# Altium schematic sheet panel5.SchDoc
size A
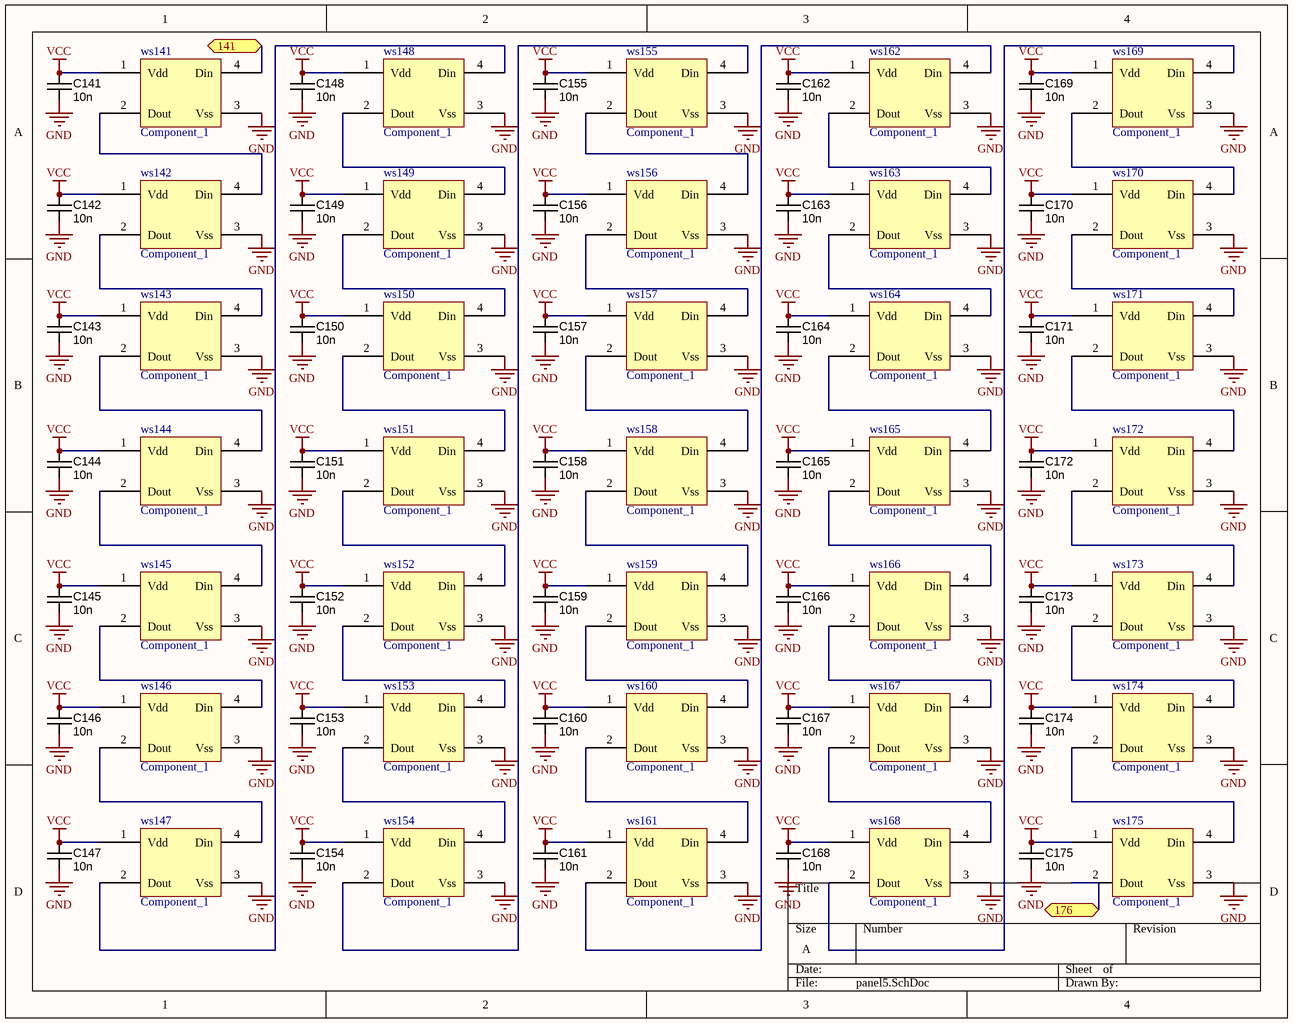
[diagram p0: panel5.SchDoc]

## Parts
C141  value 10n  [CAPC1608X90N]  (hidden comment: approved sub OK)
C142  value 10n  [CAPC1608X90N]  (hidden comment: approved sub OK)
C143  value 10n  [CAPC1608X90N]  (hidden comment: approved sub OK)
C144  value 10n  [CAPC1608X90N]  (hidden comment: approved sub OK)
C145  value 10n  [CAPC1608X90N]  (hidden comment: approved sub OK)
C146  value 10n  [CAPC1608X90N]  (hidden comment: approved sub OK)
C147  value 10n  [CAPC1608X90N]  (hidden comment: approved sub OK)
C148  value 10n  [CAPC1608X90N]  (hidden comment: approved sub OK)
C149  value 10n  [CAPC1608X90N]  (hidden comment: approved sub OK)
C150  value 10n  [CAPC1608X90N]  (hidden comment: approved sub OK)
C151  value 10n  [CAPC1608X90N]  (hidden comment: approved sub OK)
C152  value 10n  [CAPC1608X90N]  (hidden comment: approved sub OK)
C153  value 10n  [CAPC1608X90N]  (hidden comment: approved sub OK)
C154  value 10n  [CAPC1608X90N]  (hidden comment: approved sub OK)
C155  value 10n  [CAPC1608X90N]  (hidden comment: approved sub OK)
C156  value 10n  [CAPC1608X90N]  (hidden comment: approved sub OK)
C157  value 10n  [CAPC1608X90N]  (hidden comment: approved sub OK)
C158  value 10n  [CAPC1608X90N]  (hidden comment: approved sub OK)
C159  value 10n  [CAPC1608X90N]  (hidden comment: approved sub OK)
C160  value 10n  [CAPC1608X90N]  (hidden comment: approved sub OK)
C161  value 10n  [CAPC1608X90N]  (hidden comment: approved sub OK)
C162  value 10n  [CAPC1608X90N]  (hidden comment: approved sub OK)
C163  value 10n  [CAPC1608X90N]  (hidden comment: approved sub OK)
C164  value 10n  [CAPC1608X90N]  (hidden comment: approved sub OK)
C165  value 10n  [CAPC1608X90N]  (hidden comment: approved sub OK)
C166  value 10n  [CAPC1608X90N]  (hidden comment: approved sub OK)
C167  value 10n  [CAPC1608X90N]  (hidden comment: approved sub OK)
C168  value 10n  [CAPC1608X90N]  (hidden comment: approved sub OK)
C169  value 10n  [CAPC1608X90N]  (hidden comment: approved sub OK)
C170  value 10n  [CAPC1608X90N]  (hidden comment: approved sub OK)
C171  value 10n  [CAPC1608X90N]  (hidden comment: approved sub OK)
C172  value 10n  [CAPC1608X90N]  (hidden comment: approved sub OK)
C173  value 10n  [CAPC1608X90N]  (hidden comment: approved sub OK)
C174  value 10n  [CAPC1608X90N]  (hidden comment: approved sub OK)
C175  value 10n  [CAPC1608X90N]  (hidden comment: approved sub OK)
ws141  Component_1  [SOP4]
ws142  Component_1  [SOP4]
ws143  Component_1  [SOP4]
ws144  Component_1  [SOP4]
ws145  Component_1  [SOP4]
ws146  Component_1  [SOP4]
ws147  Component_1  [SOP4]
ws148  Component_1  [SOP4]
ws149  Component_1  [SOP4]
ws150  Component_1  [SOP4]
ws151  Component_1  [SOP4]
ws152  Component_1  [SOP4]
ws153  Component_1  [SOP4]
ws154  Component_1  [SOP4]
ws155  Component_1  [SOP4]
ws156  Component_1  [SOP4]
ws157  Component_1  [SOP4]
ws158  Component_1  [SOP4]
ws159  Component_1  [SOP4]
ws160  Component_1  [SOP4]
ws161  Component_1  [SOP4]
ws162  Component_1  [SOP4]
ws163  Component_1  [SOP4]
ws164  Component_1  [SOP4]
ws165  Component_1  [SOP4]
ws166  Component_1  [SOP4]
ws167  Component_1  [SOP4]
ws168  Component_1  [SOP4]
ws169  Component_1  [SOP4]
ws170  Component_1  [SOP4]
ws171  Component_1  [SOP4]
ws172  Component_1  [SOP4]
ws173  Component_1  [SOP4]
ws174  Component_1  [SOP4]
ws175  Component_1  [SOP4]

## Ports
141, 176

## Nets
GND: C141.2 C142.2 C143.2 C144.2 C145.2 C146.2 C147.2 C148.2 C149.2 C150.2 C151.2 C152.2 C153.2 C154.2 C155.2 C156.2 C157.2 C158.2 C159.2 C160.2 C161.2 C162.2 C163.2 C164.2 C165.2 C166.2 C167.2 C168.2 C169.2 C170.2 C171.2 C172.2 C173.2 C174.2 C175.2 ws141.3(Vss) ws142.3(Vss) ws143.3(Vss) ws144.3(Vss) ws145.3(Vss) ws146.3(Vss) ws147.3(Vss) ws148.3(Vss) ws149.3(Vss) ws150.3(Vss) ws151.3(Vss) ws152.3(Vss) ws153.3(Vss) ws154.3(Vss) ws155.3(Vss) ws156.3(Vss) ws157.3(Vss) ws158.3(Vss) ws159.3(Vss) ws160.3(Vss) ws161.3(Vss) ws162.3(Vss) ws163.3(Vss) ws164.3(Vss) ws165.3(Vss) ws166.3(Vss) ws167.3(Vss) ws168.3(Vss) ws169.3(Vss) ws170.3(Vss) ws171.3(Vss) ws172.3(Vss) ws173.3(Vss) ws174.3(Vss) ws175.3(Vss)
VCC: C141.1 C142.1 C143.1 C144.1 C145.1 C146.1 C147.1 C148.1 C149.1 C150.1 C151.1 C152.1 C153.1 C154.1 C155.1 C156.1 C157.1 C158.1 C159.1 C160.1 C161.1 C162.1 C163.1 C164.1 C165.1 C166.1 C167.1 C168.1 C169.1 C170.1 C171.1 C172.1 C173.1 C174.1 C175.1 ws141.1(Vdd) ws142.1(Vdd) ws143.1(Vdd) ws144.1(Vdd) ws145.1(Vdd) ws146.1(Vdd) ws147.1(Vdd) ws148.1(Vdd) ws149.1(Vdd) ws150.1(Vdd) ws151.1(Vdd) ws152.1(Vdd) ws153.1(Vdd) ws154.1(Vdd) ws155.1(Vdd) ws156.1(Vdd) ws157.1(Vdd) ws158.1(Vdd) ws159.1(Vdd) ws160.1(Vdd) ws161.1(Vdd) ws162.1(Vdd) ws163.1(Vdd) ws164.1(Vdd) ws165.1(Vdd) ws166.1(Vdd) ws167.1(Vdd) ws168.1(Vdd) ws169.1(Vdd) ws170.1(Vdd) ws171.1(Vdd) ws172.1(Vdd) ws173.1(Vdd) ws174.1(Vdd) ws175.1(Vdd)
141: ws141.4(Din) ; port 141
176: ws175.2(Dout) ; port 176
Netws141_2: ws141.2(Dout) ws142.4(Din)
Netws142_2: ws142.2(Dout) ws143.4(Din)
Netws143_2: ws143.2(Dout) ws144.4(Din)
Netws144_2: ws144.2(Dout) ws145.4(Din)
Netws145_2: ws145.2(Dout) ws146.4(Din)
Netws146_2: ws146.2(Dout) ws147.4(Din)
Netws147_2: ws147.2(Dout) ws148.4(Din)
Netws148_2: ws148.2(Dout) ws149.4(Din)
Netws149_2: ws149.2(Dout) ws150.4(Din)
Netws150_2: ws150.2(Dout) ws151.4(Din)
Netws151_2: ws151.2(Dout) ws152.4(Din)
Netws152_2: ws152.2(Dout) ws153.4(Din)
Netws153_2: ws153.2(Dout) ws154.4(Din)
Netws154_2: ws154.2(Dout) ws155.4(Din)
Netws155_2: ws155.2(Dout) ws156.4(Din)
Netws156_2: ws156.2(Dout) ws157.4(Din)
Netws157_2: ws157.2(Dout) ws158.4(Din)
Netws158_2: ws158.2(Dout) ws159.4(Din)
Netws159_2: ws159.2(Dout) ws160.4(Din)
Netws160_2: ws160.2(Dout) ws161.4(Din)
Netws161_2: ws161.2(Dout) ws162.4(Din)
Netws162_2: ws162.2(Dout) ws163.4(Din)
Netws163_2: ws163.2(Dout) ws164.4(Din)
Netws164_2: ws164.2(Dout) ws165.4(Din)
Netws165_2: ws165.2(Dout) ws166.4(Din)
Netws166_2: ws166.2(Dout) ws167.4(Din)
Netws167_2: ws167.2(Dout) ws168.4(Din)
Netws168_2: ws168.2(Dout) ws169.4(Din)
Netws169_2: ws169.2(Dout) ws170.4(Din)
Netws170_2: ws170.2(Dout) ws171.4(Din)
Netws171_2: ws171.2(Dout) ws172.4(Din)
Netws172_2: ws172.2(Dout) ws173.4(Din)
Netws173_2: ws173.2(Dout) ws174.4(Din)
Netws174_2: ws174.2(Dout) ws175.4(Din)

## Library data of the parts
C141-C175 = CAPC_10n_0603_X7R_100V_10%: Capacitor SMD Cer 10nF 10% 100V X7R 0603; Manufacturer: Murata Electronics North America; Manufacturer Part Number: GCM188R72A103KA37D; Ratings: 100V; X7R; Material: ceramic; SCDType: undef; Package / Case: 0603 (1608 metric); Tolerance: ±10%; Supplier 1: Digi-Key; Supplier Part Number 1: 490-4781-1-ND